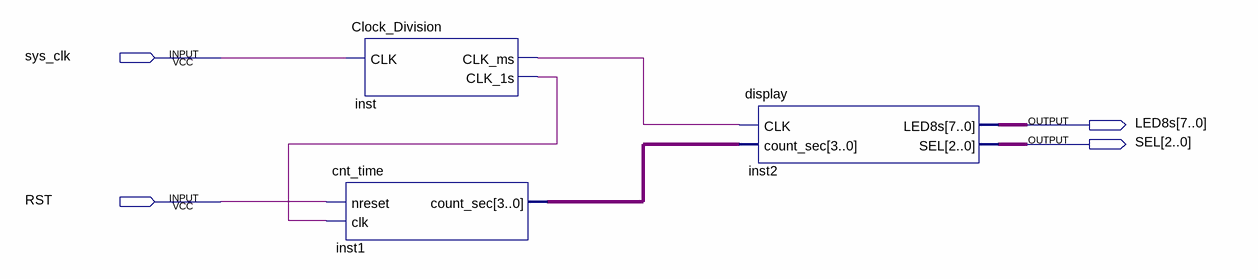
[diagram p0: schematic sheet]
// Quartus schematic smg_display.bdf as structural Verilog: 3 symbols, 4 pins
module smg_display (
  input  sys_clk,
  input  RST,
  output [7:0] LED8s,
  output [2:0] SEL
);

  wire inst_clk_1s, inst_clk_ms;
  wire [3:0] inst1_count_sec;

  Clock_Division inst (.CLK(sys_clk), .CLK_ms(inst_clk_ms), .CLK_1s(inst_clk_1s));
  cnt_time inst1 (.nreset(RST), .clk(inst_clk_1s), .count_sec(inst1_count_sec));
  display inst2 (.CLK(inst_clk_ms), .count_sec(inst1_count_sec), .LED8s(LED8s), .SEL(SEL));
endmodule
